# EAGLE design mapleCUx_large_400-012 (EAGLE 9.3.0)
MAPLE-CUx Large Version
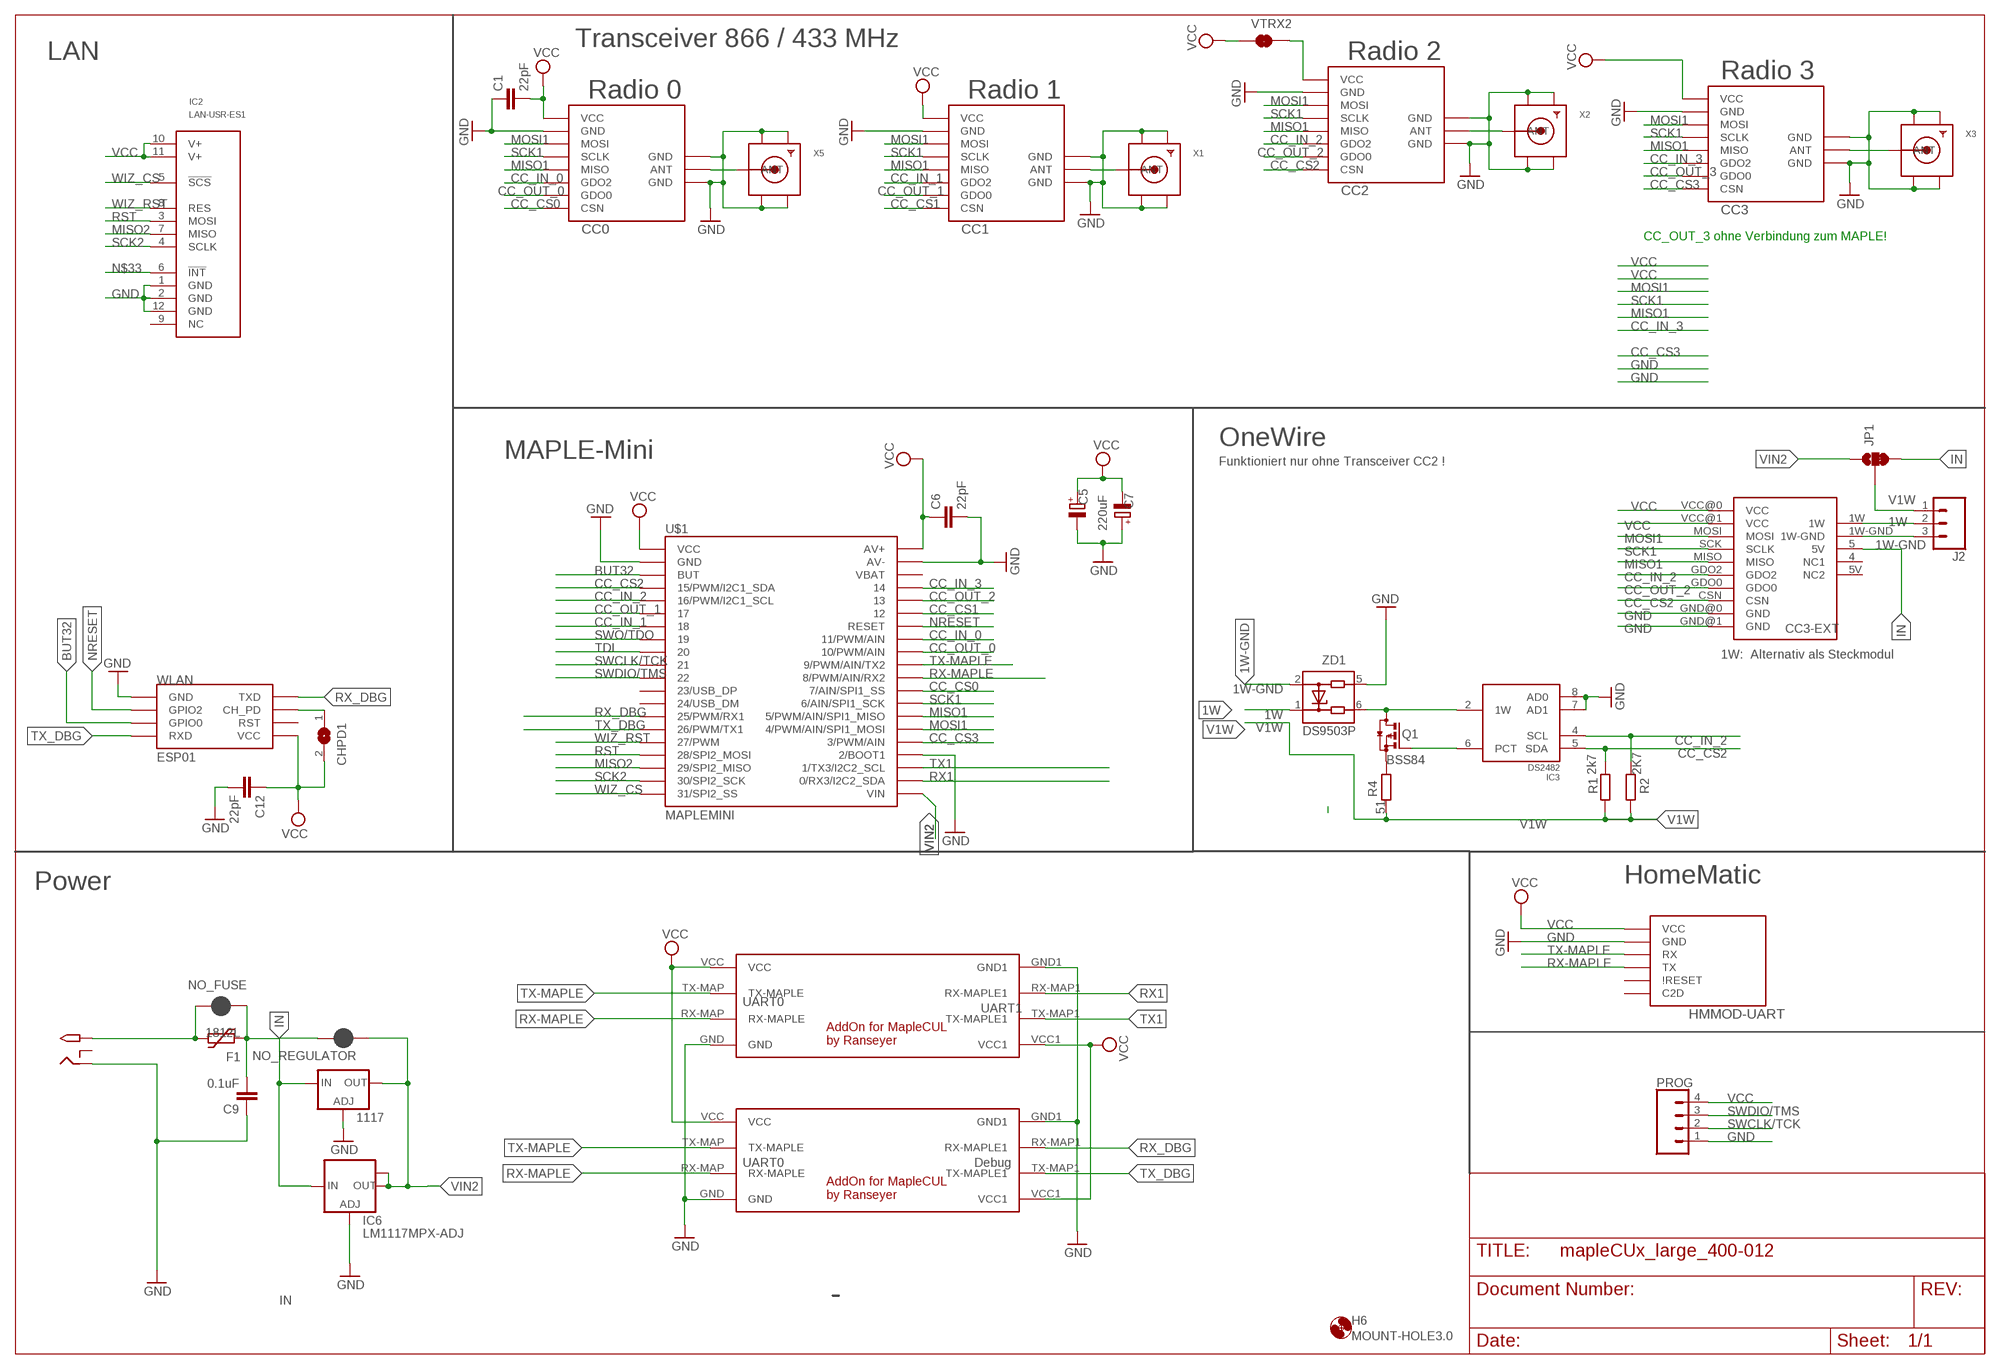
[diagram p0: schematic, sheet 1]

## Parts
1117  LD117ADT50TR  [DPACK]
C1  22pF  C-EUC0805  [C0805]
C5  220uF  CPOL-EUE5-8.5  [E5-8,5]
C6  22pF  C-EUC0805  [C0805]
C7  CPOL-EUSMCE  [SMC_E]
C9  0.1uF  C-EUC1206  [C1206]
C12  22pF  C-EUC0805  [C0805]
CC0  CC1101  CC1101_MODULE1SMD  [CC1101_MODULE1_SMD]
CC1  CC1101_MODULE1SMD  [CC1101_MODULE1_SMD]
CC2  CC1101_MODULE1SMD  [CC1101_MODULE1_SMD]
CC3  CC1101_MODULE1SMD  [CC1101_MODULE1_SMD]
CC3-EXT  ONEWIRE-MODULE  [ONEWIRE_CC1101_MODULE3_DIL]
CHPD1  SJ  [SJ]
F1  1812L  [1812L]
H6  MOUNT-HOLE3.0  [3,0]
HMMOD-UART  HM-MOD-UARTDIL  [HM-MOD-UART-DIL]
IC2  LAN-USR-ES1  [USR-ES1]
IC3  DS2482  DS2482-100S  [SO08]
IC6  LM1117MPX-ADJ  [SOT223]
J2  CONN_03LONGPADS  [1X03_LONGPADS]
JP1  JUMPER-SMT_3_1-NC_TRACE_SILK  [SMT-JUMPER_3_1-NC_TRACE_SILK]
NO_FUSE  JUMPER-SMT_2_NC_PASTE_NO-SILK  [SMT-JUMPER_2_NC_PASTE_NO-SILK]
NO_REGULATOR  JUMPER-SMT_2_NC_PASTE_NO-SILK  [SMT-JUMPER_2_NC_PASTE_NO-SILK]
PROG  CONN_04LOCK  [1X04_LOCK]
Q1  BSS84  [SOT23]
R1  2k7  R-EU_R0805  [R0805]
R2  2K7  R-EU_R0805  [R0805]
R4  51  R-EU_R0805  [R0805]
U$1  MAPLEMINI  [20-DIP]
U$2  2.1MMJACKTHM  [PJ-102A]
U$3  MAPLE-CUL-ADDON-V01  [MAPLE-CUL-V01]
U$4  MAPLE-CUL-ADDON-V01  [MAPLE-CUL-V01]
VTRX2  JUMPER-SMT_2_NC_TRACE_SILK  [SMT-JUMPER_2_NC_TRACE_SILK]
WLAN  ESP01  [ESP01]
X1  SMACONNECTOR_EDGE  [SMA_EDGELAUNCH]
X2  SMACONNECTOR_EDGE  [SMA_EDGELAUNCH]
X3  SMACONNECTOR_EDGE  [SMA_EDGELAUNCH]
X5  SMACONNECTOR_EDGE  [SMA_EDGELAUNCH]
ZD1  DS9503P  [TSOC6]

## Nets
1W: CC3-EXT.1W J2.2 ZD1.1
1W-GND: CC3-EXT.1W-GND J2.3 ZD1.2
ANT0: CC0.ANT X5.P(ANT)
ANT1: CC1.ANT X1.P(ANT)
ANT2: CC2.ANT X2.P(ANT)
ANT3: CC3.ANT X3.P(ANT)
BUT32: U$1.3(BUT) WLAN.GPIO0
CC_CS0: CC0.CSN U$1.29(7/AIN/SPI1_SS)
CC_CS1: CC1.CSN U$1.35
CC_CS2: CC2.CSN CC3-EXT.CSN IC3.5(SDA) R1.2 U$1.4(15/PWM/I2C1_SDA)
CC_CS3: CC3.CSN U$1.25(3/PWM/AIN)
CC_IN_0: CC0.GDO2 U$1.33(11/PWM/AIN)
CC_IN_1: CC1.GDO2 U$1.7
CC_IN_2: CC2.GDO2 CC3-EXT.GDO2 IC3.4(SCL) R2.2 U$1.5(16/PWM/I2C1_SCL)
CC_IN_3: CC3.GDO2 U$1.37
CC_OUT_0: CC0.GDO0 U$1.32(10/PWM/AIN)
CC_OUT_1: CC1.GDO0 U$1.6
CC_OUT_2: CC2.GDO0 CC3-EXT.GDO0 U$1.36
CC_OUT_3: CC3.GDO0
GND [Power]: 1117.1(ADJ) C1.1 C5.- C6.2 C7.+ C9.1 C12.2 CC0.GND@0(GND) CC0.GND@1(GND) CC0.GND@2(GND) CC1.GND@0(GND) CC1.GND@1(GND) CC1.GND@2(GND) CC2.GND@0(GND) CC2.GND@1(GND) CC2.GND@2(GND) CC3-EXT.GND@0(GND) CC3-EXT.GND@1(GND) CC3.GND@0(GND) CC3.GND@1(GND) CC3.GND@2(GND) HMMOD-UART.2(GND) IC2.1(GND) IC2.2(GND) IC2.12(GND) IC3.7(AD1) IC3.8(AD0) IC6.1(ADJ) PROG.1 U$1.2(GND) U$1.24(2/BOOT1) U$1.39(AV-) U$2.RING U$3.GND U$3.GND1 U$4.GND U$4.GND1 WLAN.GND X1.GND@1(GND4) X1.GND@2(GND3) X1.GND@3(GND2) X1.GND@4(GND1) X2.GND@1(GND4) X2.GND@2(GND3) X2.GND@3(GND2) X2.GND@4(GND1) X3.GND@1(GND4) X3.GND@2(GND3) X3.GND@3(GND2) X3.GND@4(GND1) X5.GND@1(GND4) X5.GND@2(GND3) X5.GND@3(GND2) X5.GND@4(GND1) ZD1.5
IN [Power]: 1117.3(IN) C9.2 CC3-EXT.5(5V) F1.P$1 IC6.3(IN) JP1.3 NO_FUSE.1 NO_REGULATOR.2
MISO1: CC0.MISO CC1.MISO CC2.MISO CC3-EXT.MISO CC3.MISO U$1.27(5/PWM/AIN/SPI1_MISO)
MISO2: IC2.7(MISO) U$1.18(29/SPI2_MISO)
MOSI1: CC0.MOSI CC1.MOSI CC2.MOSI CC3-EXT.MOSI CC3.MOSI U$1.26(4/PWM/AIN/SPI1_MOSI)
N$1 [Power]: CC2.VCC VTRX2.2
N$2: CHPD1.1 WLAN.CH_PD
N$33: IC2.6(!INT!)
N$47: IC3.6(PCT) Q1.1(G)
N$48: IC3.2(1W) Q1.3(D) ZD1.6
N$52: Q1.2(S) R4.1
NRESET: U$1.34(RESET) WLAN.GPIO2
RST: IC2.3(MOSI) U$1.17(28/SPI2_MOSI)
RX1: U$1.22(0/RX3/I2C2_SDA) U$3.RX-MAP1(RX-MAPLE1)
RX-MAPLE: HMMOD-UART.5(TX) U$1.30(8/PWM/AIN/RX2) U$3.RX-MAP(RX-MAPLE) U$4.RX-MAP(RX-MAPLE)
RX_DBG: U$1.14(25/PWM/RX1) U$4.RX-MAP1(RX-MAPLE1) WLAN.TX(TXD)
SCK1: CC0.SCLK CC1.SCLK CC2.SCLK CC3-EXT.SCK(SCLK) CC3.SCLK U$1.28(6/AIN/SPI1_SCK)
SCK2: IC2.4(SCLK) U$1.19(30/SPI2_SCK)
SWCLK/TCK: PROG.2 U$1.10
SWDIO/TMS: PROG.3 U$1.11
SWO/TDO: U$1.8
TDI: U$1.9
TX1: U$1.23(1/TX3/I2C2_SCL) U$3.TX-MAP1(TX-MAPLE1)
TX-MAPLE: HMMOD-UART.6(RX) U$1.31(9/PWM/AIN/TX2) U$3.TX-MAP(TX-MAPLE) U$4.TX-MAP(TX-MAPLE)
TX_DBG: U$1.15(26/PWM/TX1) U$4.TX-MAP1(TX-MAPLE1) WLAN.RX(RXD)
V1W [Power]: J2.1 JP1.2 R1.1 R2.1 R4.2
VCC [Power]: C1.2 C5.+ C6.1 C7.- C12.1 CC0.VCC CC1.VCC CC3-EXT.VCC@0(VCC) CC3-EXT.VCC@1(VCC) CC3.VCC CHPD1.2 HMMOD-UART.1(VCC) IC2.10(V+) IC2.11(V+) PROG.4 U$1.1(VCC) U$1.40(AV+) U$3.VCC U$3.VCC1 U$4.VCC U$4.VCC1 VTRX2.1 WLAN.VCC
VIN [Power]: F1.P$2 NO_FUSE.2 U$2.TIP
VIN2 [Power]: 1117.4(OUT) IC6.2(OUT) IC6.TAB(OUT1) JP1.1 NO_REGULATOR.1 U$1.21(VIN)
WIZ_CS: IC2.5(!SCS!) U$1.20(31/SPI2_SS)
WIZ_RST: IC2.8(RES) U$1.16(27/PWM)
Unconnected: CC3-EXT.4(NC1) CC3-EXT.5V(NC2) HMMOD-UART.3(C2D) HMMOD-UART.4(\!RESET) IC2.9(NC) U$1.12(23/USB_DP) U$1.13(24/USB_DM) U$1.38(VBAT) U$2.RING_SW WLAN.RST

## Notes on the sheet
- Transceiver 866 / 433 MHz
- LAN | Radio 2
- Radio 3
- Radio 0 | Radio 1
- CC_OUT_3 ohne Verbindung zum MAPLE!
- OneWire
- MAPLE-Mini
- Funktioniert nur ohne Transceiver CC2 !
- 1W:  Alternativ als Steckmodul
- Power | HomeMatic
- UART0
- UART1
- UART0 | Debug

## Power pins joined to a net without a drawn wire
GND: IC3.3(GND)
V1W: IC3.1(VDD)

## Library data of the parts
1117 = v-reg:LD117A?*: Low drop fixed and adjustable positive voltage regulators 1 A Source: http://www.st.com/stonline/products/literature/ds/7194/ld1117axx.pdf
C1 C6 C9 C12 = rcl:C-EU: CAPACITOR, European symbol
C5 = rcl:CPOL-EU: POLARIZED CAPACITOR, European symbol
C7 = rcl:CPOL-EU: POLARIZED CAPACITOR, European symbol; SPICEPREFIX: C
CC0 CC1-CC3 = wireless:CC1101_MODULE1: CC1101 wireless module for 433/868 MHz (sold from Aliexpress). DIL version for mounting with pin header (and SMD soldering) and SMD only variant available.
CC3-EXT = CC1101:ONEWIRE-MODULE
CHPD1 = jumper:SJ: SMD solder JUMPER
F1 = ptc-littlefuse:1812L
H6 = holes:MOUNT-HOLE: MOUNTING HOLE with drill center marker
HMMOD-UART = wireless:HM-MOD-UART: eQ3 HM-MOD-UART-AW-SH2 wireless module for 868 MHz. DIL version for mounting with pin header (antenna upwards) and SMD variant available (antenna downwards).
IC2 = Martin-Communication:LAN-USR-ES1
IC3 = 1wire:DS2482-100: I2C to 1-Wire Host Adapter/Line Driver This device is a onewire host and I2C interface in one chip. It provides the complete DC/AC requirements for onewire communication, including overdrive speed mode, but, unlike the DS2480B chip, no 12V EPROM programming. Notes: For overdrive speed and 5V EEPROM programming, an external active pullup circuit must be connected to the 1W, VDD and PCT pin. See the datasheet for details. The lower two I2C adress bits of the chip can be selected by external pins, so up to 4 chips may be connected to the same I2C bus. Author: Orginal device and description from Giovanni Varasano <giovanni.varasano@fastwebnet.it> Improved by Jan Kandziora <jjj@gmx.de>
IC6 = lm1117:LM1117MPX-ADJ
J2 = SparkFun-Connectors:CONN_03: Multi connection point. Often used as Generic Header-pin footprint for 0.1 inch spaced/style header connections On any of the 0.1 inch spaced packages, you can populate with these: Break Away Headers - Straight <https://www.sparkfun.com/products/116> (PRT-00116) Break Away Male Headers - Right Angle <https://www.sparkfun.com/products/553> (PRT-00553) Female Headers <https://www.sparkfun.com/products/115> (PRT-00115) Break Away Headers - Machine Pin <https://www.sparkfun.com/products/117> (PRT-00117) Break Away Female Headers - Swiss Machine Pin <https://www.sparkfun.com/products/743> (PRT-00743) Stackable Header - 3 Pin (Female, 0.1") <https://www.sparkfun.com/products/13875> (PRT-13875) For SCREWTERMINALS and SPRING TERMINALS visit here: Screw Terimnals on SparkFun.com <https://www.sparkfun.com/search/results?term=Screw+Terminals> (5mm/3.5mm/2.54mm spacing) This device is also useful as a general connection point to wire up your design to another part of your project. Our various solder wires solder well into these plated through hole pads. Hook-Up Wire - Assortment (Stranded, 22 AWG) <https://www.sparkfun.com/products/11375> (PRT-11375) Hook-Up Wire - Assortment (Solid Core, 22 AWG) <https://www.sparkfun.com/products/11367> (PRT-11367) View the entire wire category on our website here <https://www.sparkfun.com/categories/141> Special notes: Molex polarized connector foot print use with SKU : PRT-08232 with associated crimp pins and housings.
JP1 = SparkFun-Jumpers:JUMPER-SMT_3_1-NC_TRACE: Normally closed trace jumper (1 of 2 connections) This jumper has a trace between two pads so it's normally closed (NC). The other connection is normally open (NO). Use a razor knife to open the connection. For best results follow the IPC guidelines for cutting traces: Cutout at least 0.063 mm (0.005 in). Remove all loose material to clean up the cut area. Seal the cut with an approved epoxy. Reapply solder to reclose the connection, or to close the NO connection.
NO_FUSE NO_REGULATOR = SparkFun-Jumpers:JUMPER-SMT_2_NC_PASTE: Normally closed solder jumper This jumper has an aperture in the stencil to allow solder paste to bridge the split in the wire so it's normally closed (NC). Wick off the solder to open the connection. Reapply solder to reclose the connection.
PROG = SparkFun-Connectors:CONN_04: Multi connection point. Often used as Generic Header-pin footprint for 0.1 inch spaced/style header connections On any of the 0.1 inch spaced packages, you can populate with these: Break Away Headers - Straight <https://www.sparkfun.com/products/116> (PRT-00116) Break Away Male Headers - Right Angle <https://www.sparkfun.com/products/553> (PRT-00553) Female Headers <https://www.sparkfun.com/products/115> (PRT-00115) Break Away Headers - Machine Pin <https://www.sparkfun.com/products/117> (PRT-00117) Break Away Female Headers - Swiss Machine Pin <https://www.sparkfun.com/products/743> (PRT-00743) For SCREWTERMINALS and SPRING TERMINALS visit here: Screw Terimnals on SparkFun.com <https://www.sparkfun.com/search/results?term=Screw+Terminals> (5mm/3.5mm/2.54mm spacing) This device is also useful as a general connection point to wire up your design to another part of your project. Our various solder wires solder well into these plated through hole pads. Hook-Up Wire - Assortment (Stranded, 22 AWG) <https://www.sparkfun.com/products/11375> (PRT-11375) Hook-Up Wire - Assortment (Solid Core, 22 AWG) <https://www.sparkfun.com/products/11367> (PRT-11367) View the entire wire category on our website here <https://www.sparkfun.com/categories/141> Special notes: Molex polarized connector foot print use with SKU : PRT-08231 with associated crimp pins and housings. 1MM SMD Version SKU: PRT-10208; PROD_ID: CONN-09696
Q1 = transistor-small-signal:BSS84: P-CHANNEL MOS FET
R1 R2 R4 = rcl:R-EU_: RESISTOR, European symbol
U$1 = maplemini-small:MAPLEMINI
U$2 = adafruit:2.1MMJACK: 2.1mm x 5.5mm THM DC jack with internal switch. Digikey part #PJ-102A, 4UCON part #05537 2.1mm x 5.5mm SMT DC jack with internal switch. Digikey part #PJ-002A-SMT, 4UCON part #03267 By microbuilder.eu & adafruit.com
U$3 U$4 = Martin-Communication-V4:MAPLE-CUL-ADDON-V01: AddOn for MAPLE-CUL V4.x
VTRX2 = SparkFun-Jumpers:JUMPER-SMT_2_NC_TRACE: Normally closed trace jumper This jumper has a trace between two pads so it's normally closed (NC). Use a razor knife to open the connection. For best results follow the IPC guidelines for cutting traces: Cutout at least 0.063 mm (0.005 in). Remove all loose material to clean up the cut area. Seal the cut with an approved epoxy. Reapply solder to reclose the connection.
WLAN = esp8266modules:ESP01: ESP8266 Wifi module 01
X1-X3 X5 = adafruit:SMACONNECTOR: SMA Connector 90° DIP SMA Connector, 50 Ohm (4UConnector: 07259)
ZD1 = 1wire:DS9503: ESD Protection Diode with Resistors This ESD protection diode is designed especially for onewire host interfaces. Unlike the DS9502, it has two additional 5Ohm resitors in the 1W and GND line. Pin 5 and 6 have to be connected to the host side, pin 1 und 2 to the network side. The 1W line is through pin 1 and 6, the GND line is through pin 2 and 5. Author: Jan Kandziora <jjj@gmx.de>

## Net classes
0 default: width 0.305 mm
1 Power: width 0.61 mm

## Board
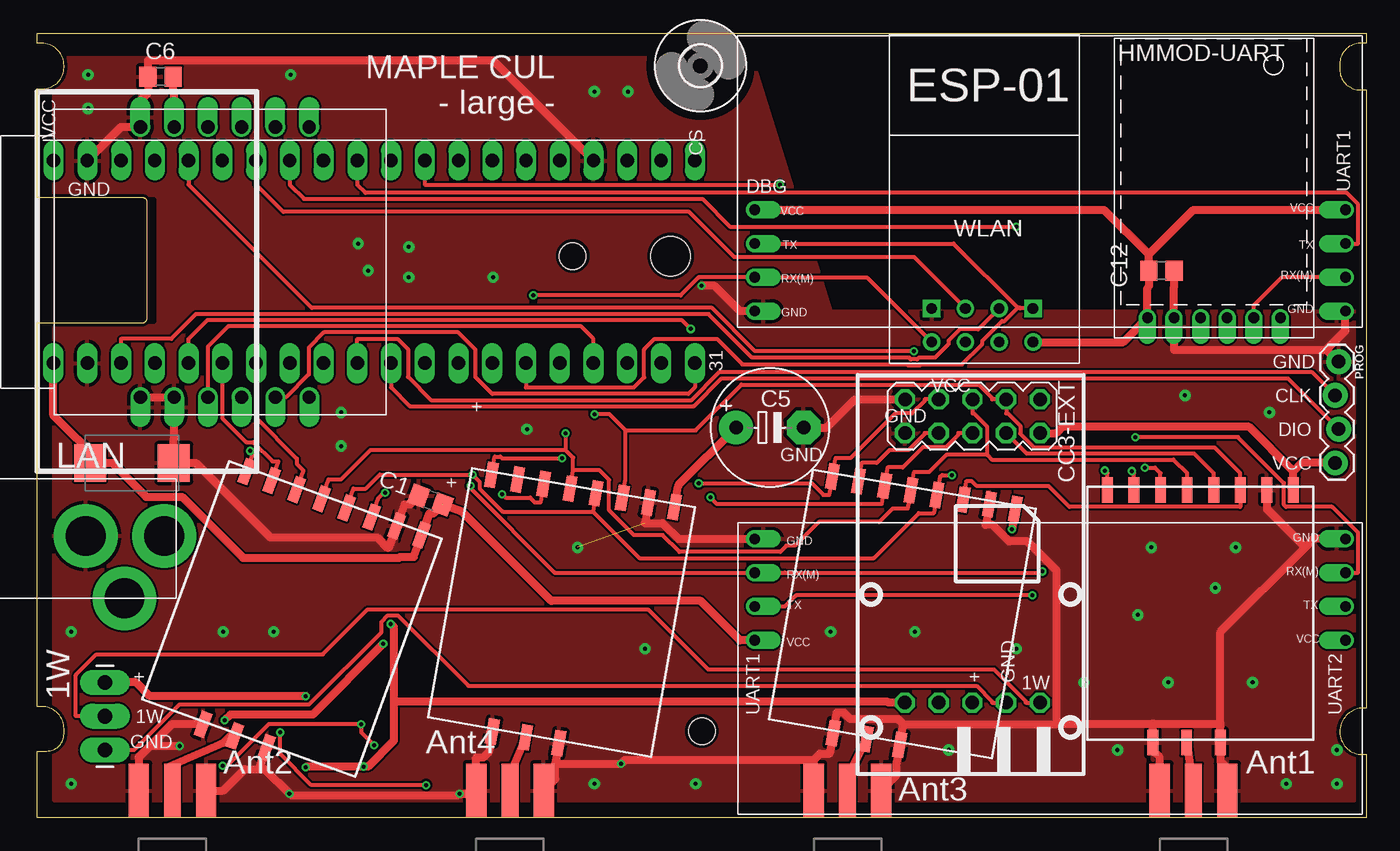
[diagram p1: board, top side]
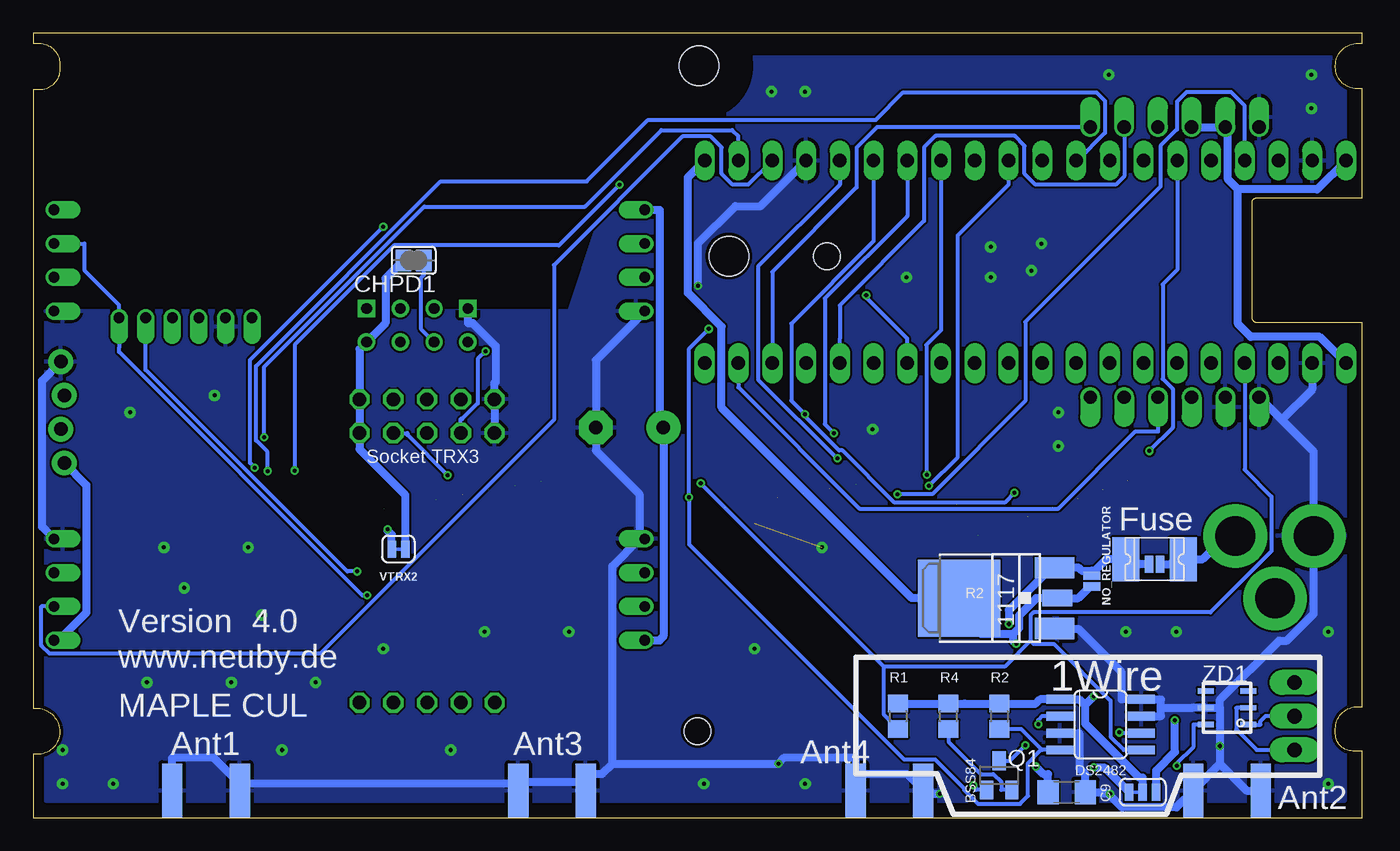
[diagram p2: board, bottom side, seen from below]

Size 100 x 59 mm. Coordinates in mm from the lower left corner, seen from the top.
Outline: 0,0 0,5 0.71,5 arc90 2,6.29 2,6.67 arc90 0.32,8.35 0,8.35 0,37.21 7.89,37.21 arc90 8.26,37.58 8.26,46.32 arc90 7.97,46.61 0,46.61 0,54.83 0.39,54.83 arc90 2,56.44 2,56.57 arc90 0.33,58.24 0,58.24 0,59 100,59 100,58.24 99.54,58.24 arc90 98,56.7 98,56.41 arc90 99.41,54.75 100,54.75 100,8.24 99.8,8.24 arc90 98,6.44 arc90 99.69,4.75 100,4.75 100,0 0,0
Copper layers (1*16): Top 0.035mm / dielectric 1.5mm / Bottom 0.035mm
Design rules "SeeedStudio_2layer_DRU_no_angle_20140221": minimum track width 6mil, minimum drill 12mil, track to track 6mil, track to pad 6mil, pad to pad 6mil, via to via 6mil, smd to smd 0mil, copper to edge 10mil, drill to drill 10mil, minimum pad ring 10mil, minimum via ring 6mil, stop-mask expansion 2mil, vias tented up to drill 100mil, thermal gap 10mil
Holes 2 mm at 50,6.5 40.28,42.23
Holes 3 mm at 47.65,42.23
tRestrict: area 0,37.3 to 8.8,46.5; area 56,48.3 to 99.1,58.4
bRestrict: area 0,37.3 to 8.8,46.5; area 56.2,48.3 to 99.1,58.4

### Footprints (pad centres in the part's own frame; a part is rotated, then mirrored left to right if it is on the bottom)
DPACK = smd 1.6 x 3: 1 -2.28,-4.8; 3 2.28,-4.8 | smd 5.8 x 6.2: 4 0,2.38
C0805 = smd 1.3 x 1.5: 1 -0.95,0; 2 0.95,0
E5-8,5 = drill 1.016 pad 2.54: + -2.54,0 | drill 1.016 pad 2.54 octagon: - 2.54,0
SMC_E = smd 2.4 x 2.8: + -3.15,0; - 3.15,0
C1206 = smd 1.6 x 1.8: 1 -1.4,0; 2 1.4,0
CC1101_MODULE1_SMD = smd 1.93 x 0.813: ANT 19,5.96; CSN 0,0; GDO0 0,2; GDO2 0,4; GND@0 0,12; GND@1 19,8.5; GND@2 19,3.42; MISO 0,6; MOSI 0,10; SCLK 0,8; VCC 0,14
ONEWIRE_CC1101_MODULE3_DIL = drill 1.016 octagon: 1W 24.638,13.716; 1W-GND 24.638,11.176; 4 24.638,6.096; 5 24.638,3.556; 5V 24.638,8.636; CSN 1.81,6.1; GDO0 4.35,6.1; GDO2 4.35,8.64; GND@0 1.81,3.56; GND@1 4.35,3.56; MISO 1.81,8.64; MOSI 1.81,11.18; SCK 4.35,11.18; VCC@0 1.81,13.72; VCC@1 4.35,13.72
SJ = smd 1.168 x 1.6: 1 -0.762,0; 2 0.762,0
1812L = smd 2.03 x 3.3: P$1 -2.16,0; P$2 2.16,0
3,0 = hole 3: 0,0
HM-MOD-UART-DIL = drill 0.8 offset: 1 0,12; 2 0,10; 3 0,8; 4 0,6; 5 0,4; 6 0,2
USR-ES1 = drill 1 pad 1.35 offset: 1 -10.16,5.715; 2 -10.16,3.175; 3 -10.16,0.635; 4 -10.16,-1.905; 5 -10.16,-4.445; 6 -10.16,-6.985; 7 10.16,-6.985; 8 10.16,-4.445; 9 10.16,-1.905; 10 10.16,0.635; 11 10.16,3.175; 12 10.16,5.715
SO08 = smd 0.66 x 2.032: 1 -1.905,-3.073; 2 -0.635,-3.073; 3 0.635,-3.073; 4 1.905,-3.073; 5 1.905,3.073; 6 0.635,3.073; 7 -0.635,3.073; 8 -1.905,3.073
SOT223 = smd 1.219 x 2.235: 1 -2.311,-3.099; 2 0,-3.099; 3 2.311,-3.099 | smd 3.6 x 2.2: TAB 0,3.099
1X03_LONGPADS = drill 1.118 pad 1.88 long: 1 0,0; 2 2.54,0; 3 5.08,0
SMT-JUMPER_3_1-NC_TRACE_SILK = smd 0.635 x 1.27: 1 -1.016,0; 2 0,0; 3 1.016,0
SMT-JUMPER_2_NC_PASTE_NO-SILK = smd 0.635 x 1.27: 1 -0.406,0; 2 0.406,0
1X04_LOCK = drill 1.016 pad 1.88: 1 0,0.127; 2 2.54,-0.127; 3 5.08,0.127; 4 7.62,-0.127
SOT23 = smd 1 x 1.4: 1 -0.95,-1.1; 2 0.95,-1.1; 3 0,1.1
R0805 = smd 1.3 x 1.5: 1 -0.95,0; 2 0.95,0
20-DIP = drill 1.016 pad 1.27 long: 1 -24.13,-7.62; 2 -21.59,-7.62; 3 -19.05,-7.62; 4 -16.51,-7.62; 5 -13.97,-7.62; 6 -11.43,-7.62; 7 -8.89,-7.62; 8 -6.35,-7.62; 9 -3.81,-7.62; 10 -1.27,-7.62; 11 1.27,-7.62; 12 3.81,-7.62; 13 6.35,-7.62; 14 8.89,-7.62; 15 11.43,-7.62; 16 13.97,-7.62; 17 16.51,-7.62; 18 19.05,-7.62; 19 21.59,-7.62; 20 24.13,-7.62 | drill 1 pad 1.27 long: 21 24.13,7.62; 22 21.59,7.62; 23 19.05,7.62; 24 16.51,7.62; 25 13.97,7.62; 26 11.43,7.62; 27 8.89,7.62; 28 6.35,7.62; 29 3.81,7.62; 30 1.27,7.62; 31 -1.27,7.62; 32 -3.81,7.62; 33 -6.35,7.62; 34 -8.89,7.62; 35 -11.43,7.62; 36 -13.97,7.62; 37 -16.51,7.62; 38 -19.05,7.62; 39 -21.59,7.62; 40 -24.13,7.62
PJ-102A = drill 3 pad 4.8: RING 0.1,-3.39; RING_SW -4.6,-6.29; TIP 0.1,-9.29
MAPLE-CUL-V01 = drill 0.8 offset: GND 1.27,12.7; GND1 45.72,12.7; RX-MAP 1.27,10.16; RX-MAP1 45.72,10.16; TX-MAP 1.27,7.62; TX-MAP1 45.72,7.62; VCC 1.27,5.08; VCC1 45.72,5.08
SMT-JUMPER_2_NC_TRACE_SILK = smd 0.635 x 1.27: 1 -0.508,0; 2 0.508,0
ESP01 = drill 0.8: CH_PD -1.285,-8.178; GPIO0 1.255,-5.638; GPIO2 -1.285,-5.638; RST 1.255,-8.178; TX -3.825,-8.178; VCC 3.795,-8.178 | drill 0.8 square: GND -3.825,-5.638; RX 3.795,-5.638
SMA_EDGELAUNCH = smd 4.064 x 1.524: GND@1 2.032,-2.54; GND@2 2.032,2.54 | smd 4.064 x 1.524 bottom: GND@3 2.032,2.54; GND@4 2.032,-2.54 | smd 4.064 x 1.27: P 2.032,0
TSOC6 = smd 0.406 x 1.219: 1 -1.27,-1.6; 2 0,-1.6; 3 1.27,-1.6; 4 1.27,1.6; 5 0,1.6; 6 -1.27,1.6

### Placement (x,y rotation side)
1117  27.94,16.51 90 bottom
C1  29.59,23.88 340 top
C5  55.12,29.34 0 top
C6  9.27,55.74 180 top
C7  7.11,26.67 180 top
C9  22.23,1.91 180 bottom
C12  84.58,41.15 0 top
CC0  80.52,24.64 270 top
CC1  15.75,26.04 250 top
CC2  59.82,25.65 260 top
CC3  34.16,25.78 260 top
CC3-EXT  61.72,33.27 270 top
CHPD1  71.37,41.91 180 bottom
F1  15.62,19.43 0 bottom
H6  49.89,56.55 0 top
HMMOD-UART  95.54,37.59 90 top
IC2  13.46,41.78 90 top
IC3  19.68,6.99 270 bottom
IC6  26.04,16.51 90 bottom
J2  5.08,10.16 270 top
JP1  16.51,1.91 180 bottom
NO_FUSE  15.62,19.05 0 bottom
NO_REGULATOR  20.32,17.78 90 bottom
PROG  97.79,34.29 270 top
Q1  27.3,3.17 0 bottom
R1  34.92,7.62 270 bottom
R2  27.3,7.62 270 bottom
R4  31.11,7.62 90 bottom
U$1  25.34,41.8 0 top
U$2  0.25,21.08 90 top
U$3  52.7,8.26 0 top
U$4  99.69,50.8 180 top
VTRX2  72.52,20.19 180 bottom
WLAN  71.12,43.94 0 top
X1  10.16,0 90 top
X2  60.96,0 90 top
X3  35.56,0 90 top
X5  87,0 90 top
ZD1  10.16,8.26 90 bottom

### Tracks (layer width: path | path; a pad name or v marks a point on that pad's centre or on a via)
1W
  Top 0.305: CC3-EXT.1W 74.37,8.64 74.37,8.75 71.98,11.14 50.47,11.14 45.94,15.66 24.86,15.66 21.47,12.28 4.44,12.28 2.9,10.73 2.9,7.62 J2.2
  Bottom 0.305: ZD1.1 7.64,6.99 7.64,7.24 7.26,7.62 J2.2
1W-GND
  Top 0.305: CC3-EXT.1W-GND 71.83,8.64 71.83,8.75 70.68,9.9 32.43,9.9 27.12,15.21 26.37,15.21 25.88,14.72 25.88,13.95 20.44,8.52 10.7,8.52 7.26,5.08 J2.3
  Bottom 0.305: ZD1.2 9.47,8.26 9.47,6.62 7.93,5.08 J2.3
ANT0
  Top 0.305: 86.48,4.89 CC0.ANT
  Top 0.61: CC0.ANT 86.87,2.79 X5.P
ANT1
  Top 0.61: CC1.ANT 14.52,6.14 13.97,5.59 9.91,3.81 X1.P
ANT2
  Top 0.61: CC2.ANT 60.96,3.05 X2.P
ANT3
  Top 0.61: CC3.ANT 35.56,3.3 X3.P
BUT32
  Top 0.305: WLAN.GPIO0 70.79,36.72 69.41,36.72 68.56,35.87 68.56,35.6 67.54,34.59 66.34,34.59 66.22,34.47 65.71,34.47 65.59,34.59 53.78,34.59 50.51,37.86 11.93,37.86 10.07,36.01 6.29,36.01 U$1.3
CC_CS0  (via drill 0.3 pad 0.61)
  Top 0.305: v80.32,26.1 80.52,25.91 CC0.CSN | v55.87,47.61 29.15,47.61 U$1.29
  Bottom 0.305: v55.87,47.61 60.43,43.05 72.83,43.05 80.32,35.56 v80.32,26.1
CC_CS1  (via drill 0.3 pad 0.61)
  Top 0.305: CC1.CSN 16.27,27.47 16.1,27.47 v15.99,27.58
  Bottom 0.305: U$1.35 13.91,41.2 15,40.11 15,33 14.24,32.24 14.24,29.32 v15.99,27.58
CC_CS2  (via drill 0.3 pad 0.61)
  Top 0.305: v49.77,25.13 58.29,25.13 59.14,24.28 59.58,24.28 CC2.CSN 60.06,27.03 61.19,27.03 64.56,30.4 65.82,30.4 66.75,31.33 66.75,31.46 CC3-EXT.CSN
  Bottom 0.305: 35.98,11.35 v49.77,25.13 | R1.2 35.98,7.72 35.98,11.35 | 24.95,13.29 26.89,11.35 35.98,11.35 | U$1.4 8.83,26.16 6.81,24.15 6.81,20.04 11.41,15.44 24.72,15.44 24.95,15.21 24.95,13.29 | 24.95,13.29 24.72,13.06 23.2,13.06 18.93,8.79 18.93,6.08 17.93,5.08 IC3.5
CC_CS3  (via drill 0.3 pad 0.61)
  Top 0.305: v39.47,27.01 34.98,27.01 34.84,27.16 34.41,27.16 CC3.CSN
  Bottom 0.305: U$1.25 39.31,47.61 45.45,41.46 45.45,32.93 39.53,27.01 v39.47,27.01
CC_IN_0  (via drill 0.3 pad 0.61)
  Top 0.305: v73.65,44.45 52.12,44.45 50.03,46.53 20.06,46.53 18.99,47.61 U$1.33 | v83.32,26.32 84.1,26.32 84.52,25.91 CC0.GDO2
  Bottom 0.305: v83.32,26.32 83.68,26.68 83.68,34.42 v73.65,44.45
CC_IN_1  (1 unrouted)
  Top 0.305: CC1.GDO2 20.03,26.1 | U$1.7 16.45,30.06 19.51,27 19.51,26.63 20.03,26.1 | 20.03,26.1
CC_IN_2  (via drill 0.3 pad 0.61)  (1 unrouted)
  Top 0.305: v49.16,36.75 48.51,37.4 12.76,37.4 11.37,36.01 U$1.5 | CC3-EXT.GDO2 69.3,28.92 69.3,28.79 68.36,27.86 66.65,27.86 65.13,26.33 64,26.33 CC2.GDO2 63.51,23.59 51.15,23.59 v50.64,24.09
  Bottom 0.305: v49.16,36.75 50.64,35.28 v50.64,24.09 50.64,20.55 34.46,4.37 32.13,4.37 29.93,2.17 29.93,2.07 28.89,1.03 25.74,1.03 25.15,1.63 25.15,4.09 24.16,5.08 24.08,5.08 | R2.2 26.25,6.67 25.67,6.67 24.08,5.08 | IC3.4 24.08,5.08
CC_IN_3  (via drill 0.3 pad 0.61)  (1 unrouted)
  Top 0.305: CC3.GDO2 37.86,23.71 37.43,23.71 37.08,24.06 35.23,24.06 v34.96,24.33
  Bottom 0.305: U$1.37 8.83,53.54 9.85,54.56 13.22,54.56 13.94,53.85 13.94,51.76 15.18,50.52 15.18,47.45 25.34,37.29 25.34,31.34 32.35,24.33 v34.96,24.33
CC_OUT_0  (via drill 0.3 pad 0.61)
  Top 0.305: v82.36,26.06 82.52,25.91 CC0.GDO0
  Bottom 0.305: v82.36,26.06 82.36,27.5 83.22,28.37 83.22,33.96 69.33,47.85 58.35,47.85 53.72,52.48 36.6,52.48 34.54,54.54 19.99,54.54 19.35,53.91 19.35,51.51 21.44,49.42 U$1.32
CC_OUT_1  (1 unrouted)
  Top 0.305: CC1.GDO0 18.15,26.79 17.69,26.79 16.24,28.24 15.71,28.24 13.91,30.05 U$1.6
CC_OUT_2  (via drill 0.3 pad 0.61)  (1 unrouted)
  Top 0.305: v65.97,35.08 54.02,35.08 50.77,38.33 20.64,38.33 11.37,47.61 U$1.36 | CC2.GDO0 62.03,26.68 63.16,26.68 64.12,27.64 65.55,27.64 66.75,28.84 66.75,28.92 CC3-EXT.GDO0
  Bottom 0.305: CC3-EXT.GDO0 67.82,29.99 67.71,29.99 66.55,31.15 66.55,34.49 v65.97,35.08
GND  (via drill 0.3 pad 0.61, 0.3 pad 0.85)  (1 unrouted)
  Top 0.61: 58.42,4.33 44.22,4.33 v43.93,4.04 38.96,4.04 | 58.42,4.33 58.89,4.8 59.61,4.8 CC2.GND@2 60.16,7.9 60.68,7.9 61.18,7.4 64.78,7.4 65.16,7.02 | X2.GND@3 58.42,4.33 | v49.97,39.99 50.97,39.99 52.86,38.1 U$4.GND1 | v49.97,39.99 | U$1.24 34.32,56.94 8.32,56.94 C6.2 8.32,54.53 7.75,53.96 IC2.12 6.27,51.94 U$1.39 | CC3-EXT.GND@0 61.51,31.46 59.38,29.34 C5.- | 95.39,20.34 92.52,23.21 CC0.GND@0 | 95.39,20.34 96.01,20.95 U$3.GND1 | 89.02,7.06 89.02,13.97 95.39,20.34 | 89.02,7.06 89.02,6.87 CC0.GND@1 89.02,4.93 89.02,4.21 89.53,3.7 X5.GND@4 | 83.94,7.06 89.02,7.06 | 76.71,7.06 83.94,7.06 | 76.71,7.06 76.71,18.57 74.5,20.77 73.12,20.77 71.88,22.02 71.36,22.02 CC2.GND@0 | 65.16,7.02 | 65.16,7.02 76.67,7.02 76.71,7.06 | 83.94,7.06 CC0.GND@2 83.94,5.04 84.45,4.52 X5.GND@3 | CC3.GND@0 45.71,22.15 47.03,22.15 48.22,20.95 U$3.GND | v10.69,5.38 8.48,5.38 | 8.48,5.38 7.62,4.52 X1.GND@3 | 16.64,3.64 17.11,3.64 v18.96,1.79 19.07,1.68 31.64,1.68 v31.76,1.79 32.78,1.79 X3.GND@3 33.02,4.52 33.55,4.52 33.96,4.92 | X1.GND@4 13.99,2.03 15.61,3.64 16.64,3.64 | CC1.GND@1 16.64,3.64 | C1.1 28.06,23.56 27.62,23.56 CC1.GND@0 26.43,20.3 26.32,20.3 25.55,21.07 17.52,21.07 11.92,26.67 C7.+ 10.26,28.53 10.26,31.62 | 33.96,4.92 | CC3.GND@2 33.96,4.92 | 65.16,7.02 CC2.GND@1 64.61,3.92 | CC3.GND@1 38.96,4.04 | C12.2 85.53,39.94 85.54,39.94 HMMOD-UART.2 85.54,35.17 96.97,35.17 97,35.2 | 10.26,31.62 IC2.2 | IC2.1 10.26,31.62 | PROG.1 97,35.2 | 97,35.2 98.42,36.62 U$4.GND | X3.GND@4 38.96,2.89 38.96,4.04 | 38.96,4.04 | 64.61,3.92 | 64.61,3.92 64.61,3.15 X2.GND@1 | CC1.GND@2 10.11,7.01 8.48,5.38
  Bottom 0.61: v49.97,39.99 49.97,43.19 47.16,46 45.27,46 U$1.24 | U$3.GND1 99.34,21.87 99.34,32.87 PROG.1 | 10.69,8.26 10.69,8.86 6.24,13.32 5.66,13.32 3.64,15.33 U$2.RING 3.64,27.52 6.03,29.91 | 10.69,8.26 11.23,8.26 ZD1.5 12.83,8.26 15.14,8.26 | 10.69,8.26 v10.69,5.38 10.69,4.04 | 10.69,4.04 8.69,2.03 X1.GND@3 | 10.69,4.04 X1.GND@4 13.96,0.77 18.06,0.77 18.96,1.67 v18.96,1.79 19.45,1.79 19.57,1.91 C9.1 20.82,3.26 21.29,3.72 21.29,6.35 IC3.3 | 15.14,8.26 15.14,8.89 IC3.8 18.09,8.89 18.09,10.92 21.36,14.2 IC6.1 23.11,14.2 1117.1 | 15.14,8.26 15.14,7.62 IC3.7 | 54.38,20.95 U$3.GND | 56.42,4.04 56.42,18.92 54.38,20.95 | 54.38,20.95 54.38,24.33 57.66,27.61 C5.- 57.66,34.42 U$4.GND1 | 56.42,4.04 57.19,3.28 58.42,3.28 58.42,2.65 | 56.42,4.04 v43.93,4.04 43.45,4.52 38.1,4.52 38.1,3.28 | 63.5,2.52 84.45,2.52 | X2.GND@1 63.5,2.52 | 58.42,2.65 63.37,2.65 63.5,2.52 | X2.GND@3 58.42,2.65 | X5.GND@4 89.53,4.52 86.45,4.52 84.45,2.52 | 38.1,3.28 34.27,3.28 X3.GND@3 32.78,1.79 v31.76,1.79 | X3.GND@4 38.1,3.28 | 6.03,29.91 IC2.1 | 6.03,29.91 3.75,32.2 U$1.2 | WLAN.GND 67.3,37.19 66.93,37.19 65.19,35.45 65.19,32.77 65.28,32.68 CC3-EXT.GND@0 CC3-EXT.GND@1 | X5.GND@3 84.45,2.52
  other vias: 3.81,55.88 3.81,53.34 19.05,55.88 41.91,54.61 44.45,54.61 34.29,40.64 24.13,43.18 27.94,40.64 22.86,27.94 22.86,30.48 36.83,29.21 40.64,20.32 88.65,17.27 82.8,15.24 24.89,41.15 27.94,42.93 92.71,30.48 86.36,31.75 83.82,20.32 90.17,20.32 73.66,12.7 66.04,13.97 97.79,2.54 97.79,5.08 93.98,2.54 91.44,10.16 85.09,10.16 78.74,10.16 81.28,5.08 68.58,5.08 49.53,2.54 41.91,2.54 45.72,12.7 59.69,13.97 13.97,13.97 17.78,13.97 2.54,2.54 2.54,13.97
  pour Bottom: 1.27,1.27 1.27,57.15 53.34,57.15 59.69,38.1 99.06,38.1 99.06,1.27
  pour Top: 1.27,1.27 1.27,57.15 53.74,57.15 59.69,38.1 99.06,38.1 99.06,1.27
IN  (via drill 0.3 pad 0.61)
  Top 0.61: v20.2,3.78 20.25,3.84 v24.54,3.84 24.87,3.84 26.81,5.78 26.81,8.71 | 26.81,8.71 63.99,8.71 64.06,8.64 CC3-EXT.5 | v26.59,14.56 26.81,14.33 26.81,8.71
  Bottom 0.61: v20.2,3.78 19.4,3.78 JP1.3 | 23.12,18.8 23.39,18.8 26.59,15.61 v26.59,14.56 | 23.12,18.8 1117.3 | 23.12,18.8 23.11,18.82 IC6.3 21.36,18.82 21.11,18.57 20.32,18.57 | C9.2 23.62,3.26 23.96,3.26 v24.54,3.84 | 20.32,18.57 20.11,18.57 19.25,19.43 F1.P$1 17.18,19.43 16.8,19.05 NO_FUSE.1 | NO_REGULATOR.2 20.32,18.57
MISO1  (via drill 0.3 pad 0.61)  (3 unrouted)
  Top 0.305: 39.74,27.64 25.04,27.64 22.82,25.42 21.91,25.42 CC1.MISO | 40.31,26.11 40.31,27.07 39.74,27.64 | v39.74,28.91 39.74,27.64 | 71.48,27.27 71.82,26.93 85.49,26.93 86.52,25.91 CC0.MISO | 40.31,26.11 42.3,26.11 43.02,25.39 43.02,23.12 44.89,21.25 47.06,21.25 48.31,19.99 55.9,19.99 56.36,20.45 57,20.45 58.8,22.24 63.35,22.24 64.35,23.24 65.48,23.24 CC2.MISO 65.97,25.99 67.1,25.99 68.39,27.27 71.48,27.27 | 40.31,26.11 | CC3-EXT.MISO 70.36,30.4 70.47,30.4 71.48,29.39 71.48,27.27 | CC3.MISO 40.31,26.11
  Bottom 0.305: U$1.27 34.23,45.25 40.42,39.05 40.42,29.59 v39.74,28.91
MISO2
  Bottom 0.305: IC2.7 36.49,51.94 38.04,50.4 38.04,47.4 44.39,41.05 U$1.18
MOSI1  (via drill 0.3 pad 0.61)  (3 unrouted)
  Top 0.305: 44.25,29.13 43.05,30.34 v41.94,30.34 | 25.67,24.05 | 25.67,24.05 26.05,24.43 v26.16,24.43 | CC1.MOSI 25.67,24.05 | 44.25,29.13 49.53,29.13 52.97,32.57 70.84,32.57 71.83,31.57 71.83,31.46 CC3-EXT.MOSI 72.9,30.93 72.9,30.4 73.03,30.4 73.97,29.46 73.97,28.88 75,27.85 88.58,27.85 90.52,25.91 90.52,25.27 CC0.MOSI 90.52,23.37 77.66,23.37 76.11,24.92 70.71,24.92 70.34,25.29 69.91,25.29 CC2.MOSI | 44.25,25.42 | 44.25,25.42 44.25,29.13 | CC3.MOSI 44.25,25.42
  Bottom 0.305: v26.16,24.43 26.9,23.69 35.19,23.69 39.12,27.62 | 39.12,27.62 | 39.12,27.62 39.36,27.62 41.94,30.2 v41.94,30.34 42.96,31.36 42.96,37.16 36.77,43.35 U$1.26
N$1  (via drill 0.3 pad 0.61)  (1 unrouted)
  Top 0.61: v73.33,21.67 | CC2.VCC v73.33,21.67
  Bottom 0.61: v73.33,21.67 73.33,21.59 73.03,21.29 VTRX2.2
N$2
  Bottom 0.305: CHPD1.1 70.61,40.8 70.8,40.62 70.8,36.73 WLAN.CH_PD
N$47  (via drill 0.3 pad 0.61)
  Top 0.305: v29.25,2.44 20.6,2.44 18.26,4.79 v18.26,6.4
  Bottom 0.305: v18.26,6.4 18.21,6.35 17.93,6.35 IC3.6 | Q1.1 29.06,2.08 29.06,2.25 v29.25,2.44
N$48  (via drill 0.3 pad 0.61)
  Top 0.305: v13.95,3.9 14.29,3.9 17.41,7.02 v24.36,7.02 24.36,6.41 v25.33,5.45
  Bottom 0.305: v25.33,5.45 26.5,4.28 Q1.3 | v24.36,7.02 24.36,7.33 24.08,7.62 IC3.2 | ZD1.6 12.68,6.99 12.68,5.34 13.95,4.07 v13.95,3.9
N$52
  Bottom 0.305: Q1.2 27.16,2.08 27.16,2.68 27.75,3.27 28.67,3.27 31.11,5.71 R4.1
NRESET
  Top 0.305: WLAN.GPIO2 65.98,42.16 52.45,42.16 49.04,45.56 18.49,45.56 16.45,47.61 U$1.34
RST
  Top 0.305: IC2.3 12.83,35.41 14.36,36.95 40.91,36.95 41.85,36.01 U$1.17
RX1  (via drill 0.3 pad 0.61)
  Top 0.305: U$3.RX-MAP1 99.38,18.41 99.38,21.41 97.43,23.37 93.95,23.37 93.81,23.51 93.81,25.16 90.34,28.62 v82.61,28.62
  Bottom 0.305: U$1.22 46.93,51.23 47.41,51.72 52.72,51.72 58.48,45.96 70.58,45.96 82.61,33.92 v82.61,28.62
RX-MAPLE  (via drill 0.3 pad 0.61)
  Top 0.305: HMMOD-UART.5 91.54,38.55 93.62,40.64 U$4.RX-MAP | v75.63,18.51 75.53,18.41 56.24,18.41 U$3.RX-MAP 38.92,18.41 32.59,24.75 v32.59,24.95
  Bottom 0.305: v32.59,24.95 30.42,27.12 30.42,43.8 26.61,47.61 U$1.30 | v75.63,18.51 76.37,18.51 91.54,33.67 HMMOD-UART.5
RX_DBG  (via drill 0.3 pad 0.61)
  Top 0.305: v37.31,39.28 48.4,39.28 49.76,40.64 U$4.RX-MAP1 62.42,40.64 WLAN.TX
  Bottom 0.305: v37.31,39.28 37.31,39.1 34.23,36.01 U$1.14
SCK1  (via drill 0.3 pad 0.61)  (3 unrouted)
  Top 0.305: CC3-EXT.SCK 74.44,27.39 87.04,27.39 88.52,25.91 CC0.SCLK | 41.8,23.02 | 41.8,23.02 35.01,23.02 33.28,24.74 33.28,25.26 v32.74,25.8 25.77,25.8 24.7,24.74 23.79,24.74 CC1.SCLK | 41.8,23.02 45.3,19.52 62.95,19.52 66.32,22.89 67.45,22.89 CC2.SCLK 67.94,25.64 67.95,25.64 68.07,25.76 v68.8,25.76 | CC3.SCLK 41.8,23.02
  Bottom 0.305: v68.8,25.76 71.83,28.79 71.83,28.92 CC3-EXT.SCK | U$1.28 31.69,36.66 32.79,35.56 32.79,25.85 v32.74,25.8
SCK2
  Bottom 0.305: IC2.4 15.37,29.06 17.05,29.06 22.87,23.23 37.81,23.23 46.93,32.35 U$1.19
SWCLK/TCK
  Top 0.305: PROG.2 95.88,33.53 51.33,33.53 49.21,31.41 29.62,31.41 27.88,33.15 27.88,35.23 27.1,36.01 24.07,36.01 U$1.10
SWDIO/TMS
  Top 0.305: PROG.3 94.1,33.03 51.48,33.03 49.4,30.95 28.01,30.95 26.61,32.35 U$1.11
TX1
  Bottom 0.305: U$1.23 46.2,47.61 47.37,47.61 48.2,48.43 48.2,50.42 49.02,51.24 51.13,51.24 60.81,41.56 60.81,29.92 78.41,12.32 98.77,12.32 99.38,12.94 99.38,15.88 U$3.TX-MAP1
TX-MAPLE  (via drill 0.3 pad 0.61)
  Top 0.305: U$3.TX-MAP 56.24,15.88 57.09,16.72 v74.87,16.72 | U$4.TX-MAP 99.38,43.18 99.38,46.12 98.52,46.99 24.68,46.99 24.07,47.61 U$1.31
  Bottom 0.305: U$4.TX-MAP 96.16,43.18 96.16,41.17 93.54,38.55 HMMOD-UART.6 93.54,35.33 93.54,35.03 75.23,16.72 v74.87,16.72
TX_DBG
  Top 0.305: 73.78,38.35 72.77,37.35 72.59,37.35 71.11,35.86 71.11,35.62 69.57,34.09 66.48,34.09 66.41,34.02 65.52,34.02 65.45,34.09 53.04,34.09 51.12,36.01 46.45,36.01 45.66,35.21 45.66,33.12 44.89,32.35 36.77,32.35 U$1.15 | 73.78,38.35 73.91,38.35 73.96,38.3 WLAN.RX | 73.78,38.35 | U$4.TX-MAP1 68.95,43.18 73.78,38.35
V1W  (via drill 0.3 pad 0.61)
  Top 0.61: J2.1 7.42,10.16 8.45,9.12 v20.19,9.12
  Bottom 0.61: R1.1 R4.2 29.91,8.57 R2.1 24.55,8.57 24.23,8.89 IC3.1 21.29,8.89 20.88,8.48 20.83,8.48 | 20.83,8.48 20.83,7.06 16.77,3 16.51,3 JP1.2 | 20.83,8.48 v20.19,9.12
VCC  (3 unrouted)
  Top 0.61: 94.52,26.06 91.19,29.38 77.12,29.38 76.66,28.92 CC3-EXT.VCC@1 | WLAN.VCC 81.71,35.76 HMMOD-UART.1 83.54,39.84 83.63,39.94 C12.1 83.63,42.35 | 31.94,23.02 C1.2 29.81,22.88 29.5,22.88 CC1.VCC 28.31,19.61 27.27,19.61 27.19,19.53 15.46,19.53 10.88,24.12 8.17,24.12 5.62,26.67 4.79,26.67 | U$3.VCC 52.86,13.34 49.9,16.29 38.66,16.29 31.94,23.02 | 31.94,23.02 | 4.79,26.67 1.21,30.25 U$1.1 | C7.- 4.79,26.67 | PROG.4 95.13,26.67 94.52,26.06 | CC0.VCC 94.52,26.06 | C5.+ 48.22,24.98 48.22,24.9 | 48.22,24.9 | U$4.VCC1 80.27,45.72 83.63,42.35 | 83.63,42.35 87,45.72 U$4.VCC | IC2.11 10.29,54.66 10.22,54.73 C6.1 | CC3.VCC 48.22,24.9
  Bottom 0.61: U$4.VCC1 52.86,45.72 52.86,29.62 C5.+ 52.58,13.62 52.86,13.34 U$3.VCC | 9.35,47.25 10.1,48.01 10.1,51.75 IC2.11 IC2.10 | U$1.40 3.37,47.25 9.35,47.25 | U$1.1 3.19,36.16 8.38,36.16 9.35,37.13 9.35,47.25 | VTRX2.1 72.01,24.27 75.44,27.7 CC3-EXT.VCC@1 CC3-EXT.VCC@0 75.44,35.24 WLAN.VCC 73.49,37.19 73.49,40.56 CHPD1.2 | PROG.4 96,25 96,15.41 98.07,13.34 U$3.VCC1
VIN
  Bottom 0.61: NO_FUSE.2 14.44,19.05 14.06,19.43 F1.P$2 11.99,19.43 10.24,21.18 U$2.TIP
VIN2  (via drill 0.3 pad 0.61)
  Top 0.61: v26.03,13.06 20.71,7.75 14.53,7.75 v14.09,7.3
  Bottom 0.61: U$1.21 50.74,48.15 50.74,39.48 48.2,36.94 48.2,30.83 33.88,16.51 1117.4 IC6.TAB 29.13,14.25 28.68,13.8 26.27,13.8 | 26.27,13.8 25.82,14.24 25.82,15.2 24.51,16.51 IC6.2 21.36,16.51 20.5,17.37 NO_REGULATOR.1 | 26.27,13.8 26.27,13.31 v26.03,13.06 | JP1.1 15.49,3.53 14.09,4.93 v14.09,7.3
WIZ_CS
  Top 0.305: U$1.20 49.47,32.35 48.98,31.86 34.21,31.86 32.96,33.12 32.96,35.19 31.66,36.49 21.55,36.49 20.42,35.35 20.42,33.34 18.7,31.62 IC2.5
WIZ_RST
  Bottom 0.305: IC2.8 17.91,48.23 18.53,47.6 24.57,47.6 25.39,48.43 25.39,50.53 26.14,51.27 32.1,51.27 32.96,50.42 32.96,44.88 39.31,38.53 39.31,36.01 U$1.16

### Text on the board
tNames: MAPLE CUL / - large - | CS | VCC | GND | DBG | UART1 | 31 | GND | VCC | CLK | GND | + | DIO | LAN | GND | VCC | + | GND | 1W | + | + | 1W | 1W | UART1 | UART2 | GND | Ant4 | Ant2 | Ant1 | Ant3
bNames: Socket TRX3 | Fuse | R2 | 1Wire | Version 4.0 / www.neuby.de | R2 | R4 | R1 | MAPLE CUL | Ant3 | Ant1 | BSS84 | Ant4 | C9 | DS2482 | Ant2